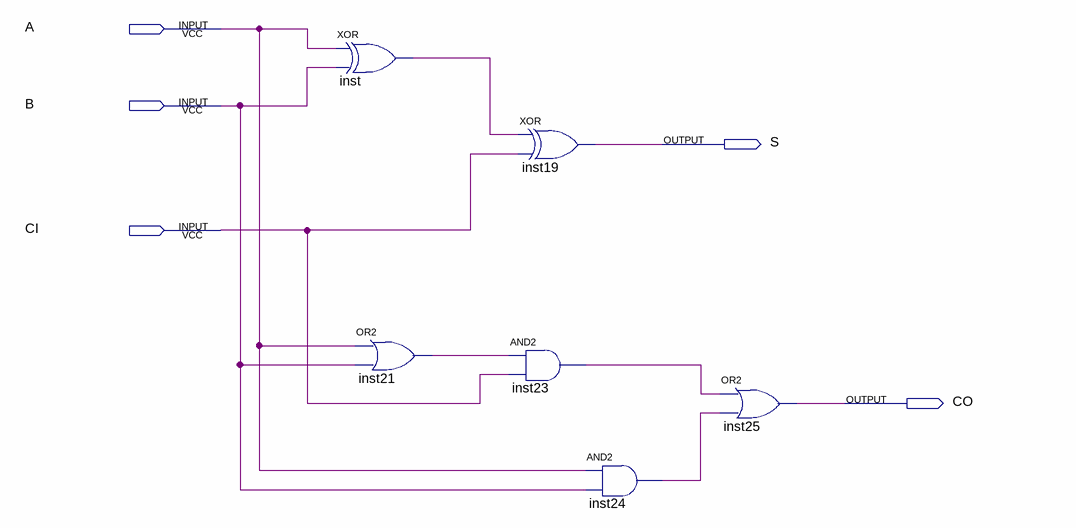
[diagram p0: schematic sheet]
// Quartus schematic aa1.bdf as structural Verilog: 6 symbols, 5 pins
module aa1 (
  input  A,
  input  B,
  input  CI,
  output S,
  output CO
);

  wire inst21_out, inst23_out, inst24_out, inst_out;

  xor inst (inst_out, A, B);
  or inst21 (inst21_out, A, B);
  xor inst19 (S, inst_out, CI);
  and inst23 (inst23_out, inst21_out, CI);
  and inst24 (inst24_out, A, B);
  or inst25 (CO, inst23_out, inst24_out);
endmodule
